# Altium project PCB_Project.PrjPcb
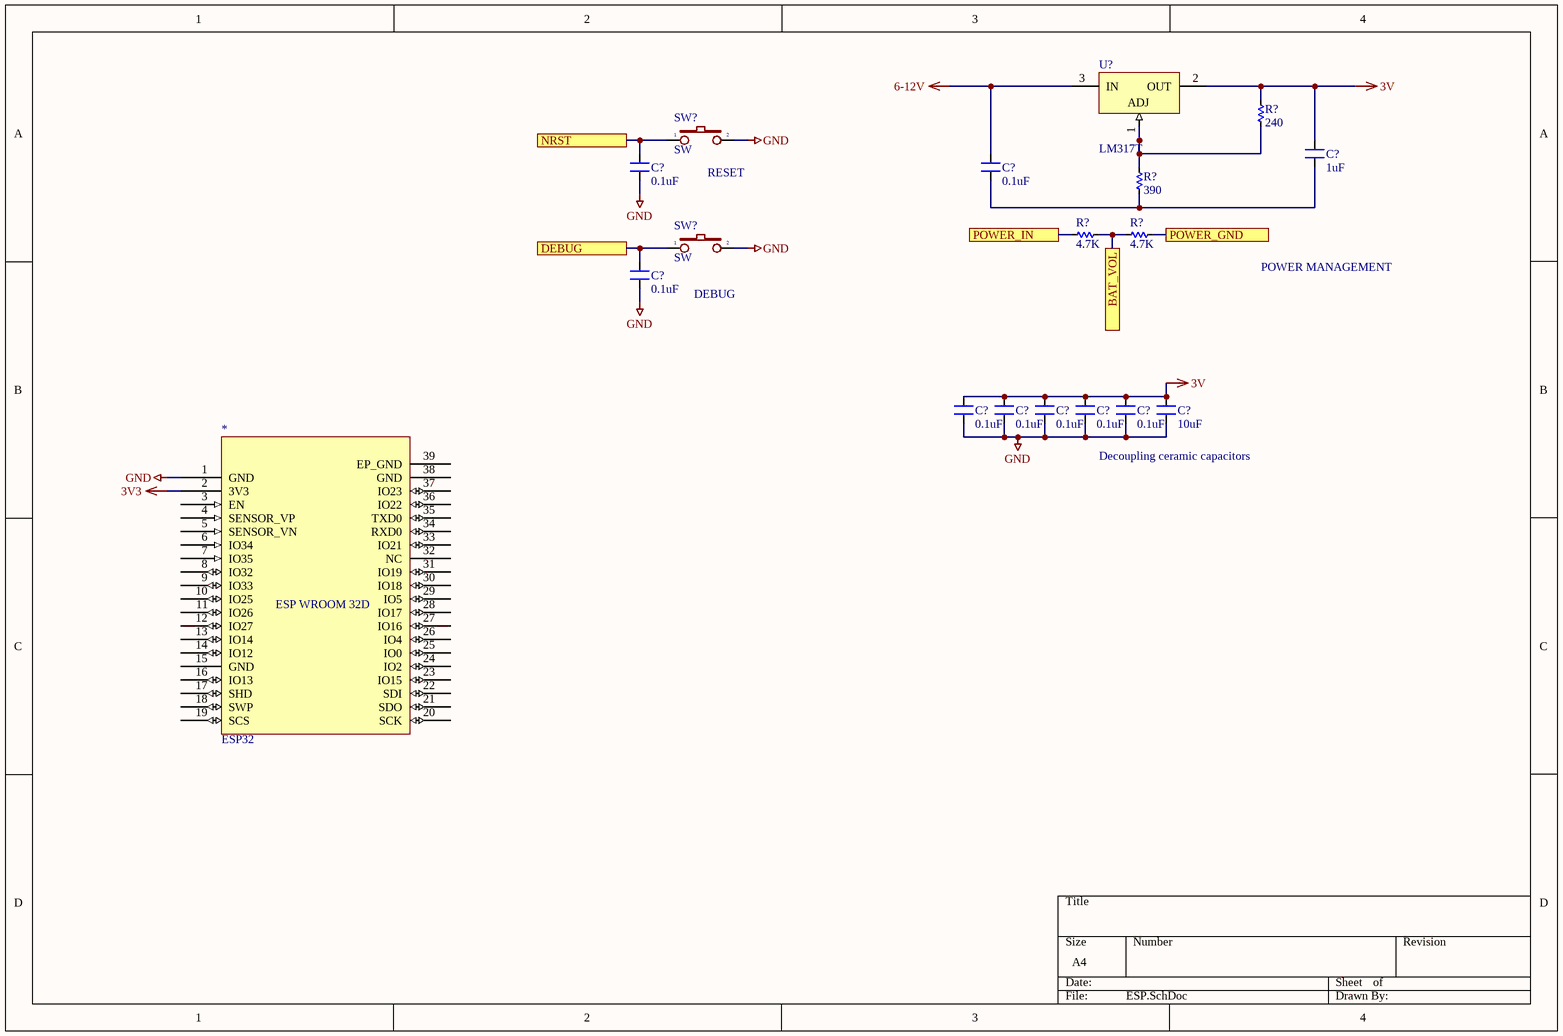
[diagram p0: ESP.SchDoc]
7 sheets, 51 parts. Net scope: flat (ports and power ports of the same name join across sheets).
Sheets:
  ESP.SchDoc
  LEFT.SchDoc
  RIGHT.SchDoc
  DRV.SchDoc
  IRSENSOR.SchDoc
  VL6180.SchDoc
  MPU6500.SchDoc

## Sheet ESP.SchDoc
size A4; SheetNumber: 1; SheetTotal: 7

### Parts
(Parts that share a designator on the sheet are numbered #1, #2 ... from top to bottom, then left to right.)
*  ESP32  [ESP32-WROOM-32D]
C?#1  1uF  [C-SE-7,5x10x9x5x4]
C?#2  0.1uF  [C-SE-7,5x10x9x5x4]
C?#3  0.1uF  [C-SE-7,5x10x9x5x4]
C?#4  0.1uF  [C-SE-7,5x10x9x5x4]
C?#5  0.1uF  [C-SE-7,5x10x9x5x4]
C?#6  0.1uF  [C-SE-7,5x10x9x5x4]
C?#7  0.1uF  [C-SE-7,5x10x9x5x4]
C?#8  0.1uF  [C-SE-7,5x10x9x5x4]
C?#9  0.1uF  [C-SE-7,5x10x9x5x4]
C?#10  10uF  [C-SE-7,5x10x9x5x4]
R?#1  240  [RES-1/2W]
R?#2  390  [RES-1/2W]
R?#3  4.7K  [RES-1/2W]
R?#4  4.7K  [RES-1/2W]
SW?#1  SW  [SW1-SMD]
SW?#2  SW  [SW1-SMD]
U?#1  LM317T  [TO-220]

### Ports
BAT_VOL, DEBUG, NRST, POWER_GND, POWER_IN

### Nets
3V: C?#1.2 C?#5.2 C?#6.2 C?#7.2 C?#8.2 C?#9.2 C?#10.2 R?#1.1 U?#1.2(OUT)
3V3: *.2(3V3)
6-12V: C?#3.2 U?#1.3(IN)
GND: *.1(GND) C?#2.1 C?#4.1 C?#5.1 C?#6.1 C?#7.1 C?#8.1 C?#9.1 C?#10.1 SW?#1.2 SW?#2.2  [project net GND_s]
NetC?#1_1: C?#1.1 C?#3.1 R?#2.2
NetC?#2_2: C?#2.2 SW?#1.1 ; port NRST
NetC?#4_2: C?#4.2 SW?#2.1 ; port DEBUG
NetR?#1_2: R?#1.2 R?#2.1 U?#1.1(ADJ)
NetR?#3_1: R?#3.1 ; port POWER_IN
NetR?#3_2: R?#3.2 R?#4.1 ; port BAT_VOL
NetR?#4_2: R?#4.2 ; port POWER_GND

Not connected (* = marked no-connect by the designer): * 3(EN) 4(SENSOR_VP) 5(SENSOR_VN) 6(IO34) 7(IO35) 8(IO32) 9(IO33) 10(IO25) 11(IO26) 12(IO27) 13(IO14) 14(IO12) 15(GND) 16(IO13) 17(SHD) 18(SWP) 19(SCS) 20(SCK) 21(SDO) 22(SDI) 23(IO15) 24(IO2) 25(IO0) 26(IO4) 27(IO16) 28(IO17) 29(IO5) 30(IO18) 31(IO19) 32(NC) 33(IO21) 34(RXD0) 35(TXD0) 36(IO22) 37(IO23) 38(GND) 39(EP_GND)

### Notes on the sheet
- (near SW?#1) RESET
- DEBUG
- POWER MANAGEMENT
- (near C?#9) Decoupling ceramic capacitors
- (in symbol Component_1) ESP WROOM 32D

### Library data of the parts
* = Component_1
C?#1-C?#10 = CN-SEMI-DIP: Capacitor (Semiconductor SIM Model); Value: 104; LatestRevisionDate: 17-Jul-2002; LatestRevisionNote: Re-released for DXP Platform.; PackageReference: C1206; Publisher: Altium Limited
R?#1-R?#4 = Res: Manufacturer: Generic Components; Class: Passive; SubClass: R; Published: 08/06/2000; Publisher: Altium Hobart Technology Centre
SW?#1 SW?#2 = SW2: Switch button 2 pin; Value: SW chip 2 pin
U?#1 = CMP-0244-00444-1: 1.5A, 1.2V to 37V Adjustable Voltage Regulator, 3-Pin TO-220; PackageVersion: 2011; ComponentLink1URL: http://www.st.com; ComponentLink2URL: http://www.st.com/internet/com/TECHNICAL_RESOURCES/TECHNICAL_LITERATURE/DATASHEET/CD00000455.pdf; PackageDescription: TO, Thru-Hole, Vertical, Heatsink Mounted; 3 In-Line Leads; Pitch 2.54 mm; PackageReference: TO-220; ComponentLink1Description: Manufacturer URL; ComponentLink3URL: http://www.st.com/internet/com/TECHNICAL_RESOURCES/TECHNICAL_LITERATURE/PACKAGE_INFORMATION/CD00004649.pdf; DatasheetVersion: 1/11/2011; ComponentLink2Description: Datasheet; ComponentLink3Description: Package Specification

## Sheet LEFT.SchDoc
size A4; SheetNumber: 2; SheetTotal: 7
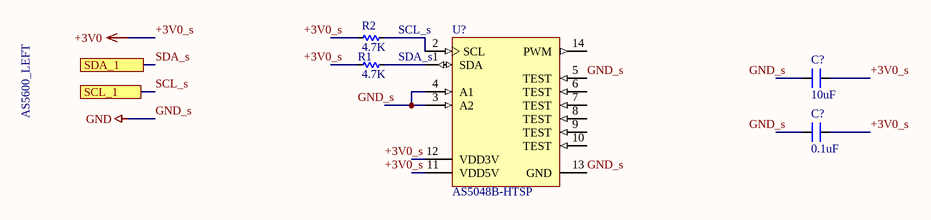
[diagram p1: LEFT.SchDoc]

### Parts
(Parts that share a designator on the sheet are numbered #1, #2 ... from top to bottom, then left to right.)
C?#11  10uF  [C-SE-7,5x10x9x5x4]
C?#12  0.1uF  [C-SE-7,5x10x9x5x4]
R1  4.7K  [RES-1/2W]
R2  4.7K  [RES-1/2W]
U?#2  AS5048B-HTSP  [AMS-TSSOP-14-5000X4400DE_N]

### Ports
SCL_1, SDA_1

### Nets
+3V0_s: C?#11.2 C?#12.2  [also labelled +3V0]
GND_s: U?#2.5(TEST) U?#2.13(GND)  [also labelled GND]
SCL_s: port SCL_1
SDA_s: port SDA_1
NetR1_1: R1.1 U?#2.1(SDA)
NetR2_1: R2.1 U?#2.2(SCL)
NetU?#2_3: U?#2.3(A2) U?#2.4(A1)

Not connected (* = marked no-connect by the designer): C?#11 1; C?#12 1; R1 2; R2 2; U?#2 6(TEST) 7(TEST) 8(TEST) 9(TEST) 10(TEST) 11(VDD5V) 12(VDD3V) 14(PWM)

### Notes on the sheet
- SCL_s
- AS5600_LEFT
- SDA_s
- Labels drawn without touching a wire or pin: +3V0_s, GND_s

### Library data of the parts
C?#11 C?#12 = CN-SEMI-DIP: as C?#1 on sheet ESP; LatestRevisionDate: 17-Jul-2002; LatestRevisionNote: Re-released for DXP Platform.; PackageReference: C1206; Publisher: Altium Limited
R1 R2 = Res: as R?#1 on sheet ESP; Published: 08/06/2000; Publisher: Altium Hobart Technology Centre
U?#2 = CMP-0555-00031-2: Magnetic Rotary Encoder 14-bit Angular Position Sensor, 3.3 or 5 V, TSSOP-14, Pb-Free, Reel; Manufacturer: AMS; Supply Voltage (V): 3.3 or 5.0; Output: IÂ²C, PWM; PackageDescription: 14-Pin Small Outline Package, 5 x 4.4 mm Body, 0.65 mm Pitch; Mounting Technology: Surface Mount; ComponentLink2URL: http://www.ams.com/eng/content/download/438523/1341157/143016; ComponentLink2Description: Datasheet; PackageReference: TSSOP-14; Features: IÂ²C, PWM, In System Programmable; PackageVersion: Rev. 2.7, 10/2010; Code_JEDEC: MO-153; DatasheetVersion: Rev. 1.3; Resolution: 14-bit; PartNumber: AS5048B-HTSP; ComponentLink1Description: Manufacturer URL; ComponentLink1URL: www.ams.com

## Sheet RIGHT.SchDoc
size A4; SheetNumber: 3; SheetTotal: 7
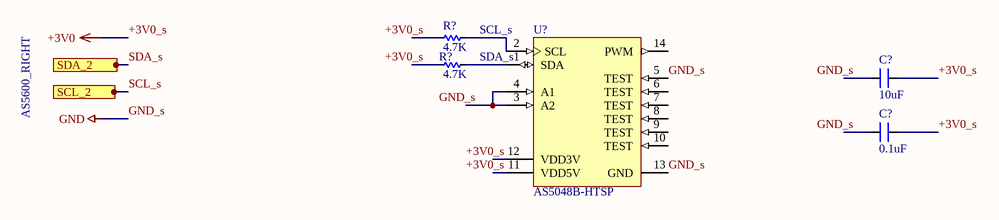
[diagram p2: RIGHT.SchDoc]

### Parts
(Parts that share a designator on the sheet are numbered #1, #2 ... from top to bottom, then left to right.)
C?#13  10uF  [C-SE-7,5x10x9x5x4]
C?#14  0.1uF  [C-SE-7,5x10x9x5x4]
R?#5  4.7K  [RES-1/2W]
R?#6  4.7K  [RES-1/2W]
U?#3  AS5048B-HTSP  [AMS-TSSOP-14-5000X4400DE_N]

### Ports
SCL_2, SDA_2

### Nets
+3V0_s: C?#13.2 C?#14.2  [also labelled +3V0]
GND_s: U?#3.5(TEST) U?#3.13(GND)  [also labelled GND]
SCL_s: port SCL_2
SDA_s: port SDA_2
NetR?#5_1: R?#5.1 U?#3.2(SCL)
NetR?#6_1: R?#6.1 U?#3.1(SDA)
NetU?#3_3: U?#3.3(A2) U?#3.4(A1)

Not connected (* = marked no-connect by the designer): C?#13 1; C?#14 1; R?#5 2; R?#6 2; U?#3 6(TEST) 7(TEST) 8(TEST) 9(TEST) 10(TEST) 11(VDD5V) 12(VDD3V) 14(PWM)

### Notes on the sheet
- SCL_s
- AS5600_RIGHT
- (near R?#6) SDA_s
- Labels drawn without touching a wire or pin: +3V0_s, GND_s

### Library data of the parts
C?#13 C?#14 = CN-SEMI-DIP: as C?#1 on sheet ESP; LatestRevisionDate: 17-Jul-2002; LatestRevisionNote: Re-released for DXP Platform.; PackageReference: C1206; Publisher: Altium Limited
R?#5 R?#6 = Res: as R?#1 on sheet ESP; Published: 08/06/2000; Publisher: Altium Hobart Technology Centre
U?#3 = CMP-0555-00031-2: as U?#2 on sheet LEFT; PackageDescription: 14-Pin Small Outline Package, 5 x 4.4 mm Body, 0.65 mm Pitch; Mounting Technology: Surface Mount; ComponentLink2URL: http://www.ams.com/eng/content/download/438523/1341157/143016; ComponentLink2Description: Datasheet; PackageReference: TSSOP-14; Features: IÂ²C, PWM, In System Programmable; PackageVersion: Rev. 2.7, 10/2010; Code_JEDEC: MO-153; DatasheetVersion: Rev. 1.3; Resolution: 14-bit; PartNumber: AS5048B-HTSP; ComponentLink1Description: Manufacturer URL; ComponentLink1URL: www.ams.com

## Sheet DRV.SchDoc
size A4; SheetNumber: 4; SheetTotal: 7
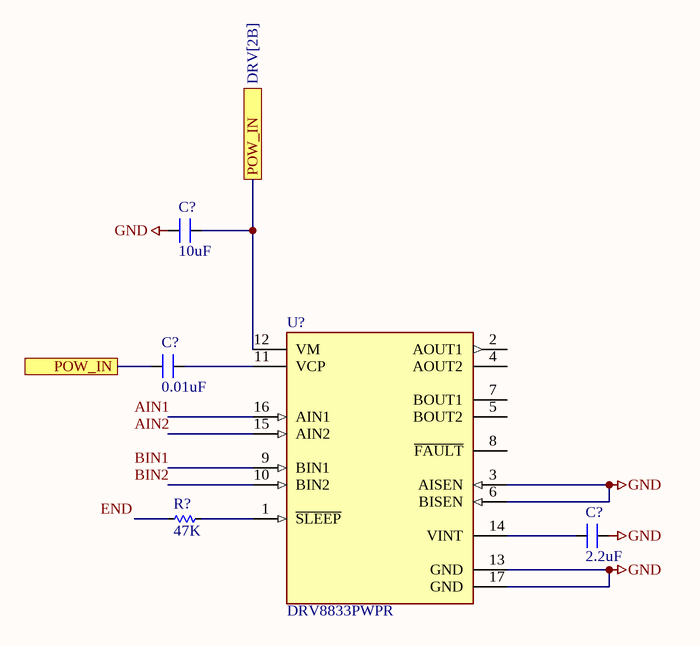
[diagram p3: DRV.SchDoc]

### Parts
(Parts that share a designator on the sheet are numbered #1, #2 ... from top to bottom, then left to right.)
C?#15  10uF  [C-SE-7,5x10x9x5x4]
C?#16  0.01uF  [C-SE-7,5x10x9x5x4]
C?#17  2.2uF  [C-SE-7,5x10x9x5x4]
R?#7  47K  [RES-1/2W]
U?#4  DRV8833PWPR  [FP-PWP0016C-IPC_A]

### Ports
POW_IN, POW_IN (see DRV[2B])

### Nets
GND: C?#15.1 C?#17.2 U?#4.3(AISEN) U?#4.6(BISEN) U?#4.13(GND) U?#4.17(GND)  [project net GND_s]
NetC?#15_2: C?#15.2 C?#16.1 U?#4.12(VM) ; port POW_IN
NetC?#16_2: C?#16.2 U?#4.11(VCP)
NetC?#17_1: C?#17.1 U?#4.14(VINT)
NetR?#7_1: R?#7.1 U?#4.1(~{SLEEP})

Not connected (* = marked no-connect by the designer): R?#7 2; U?#4 2(AOUT1) 4(AOUT2) 5(BOUT2) 7(BOUT1) 8(~{FAULT}) 9(BIN1) 10(BIN2) 15(AIN2) 16(AIN1)

### Notes on the sheet
- Labels drawn without touching a wire or pin: AIN1, AIN2, BIN1, BIN2, END

### Library data of the parts
C?#15-C?#17 = CN-SEMI-DIP: as C?#1 on sheet ESP; LatestRevisionDate: 17-Jul-2002; LatestRevisionNote: Re-released for DXP Platform.; PackageReference: C1206; Publisher: Altium Limited
R?#7 = Res: as R?#1 on sheet ESP; Published: 08/06/2000; Publisher: Altium Hobart Technology Centre
U?#4 = CMP-1529-00004-3: IC MOTOR DRIVER PAR 16HTSSOP; Supply Current: 3mA; Max Output Current: 2A; Interface: PWM; Output Current: 1.5A; Max Supply Voltage: 10.8V; Fault Protection: Over Temperature; Number of Outputs: 2; Min Supply Voltage: 2.7V; Nominal Supply Current: 3mA; Series: DRV8833; Min Operating Temperature: -40°C; Package Quantity: 2000; Packaging: Tape and Reel; Case/Package: HTSSOP; Output Current per Channel: 1.5A; RoHS Compliant: Yes; RMS Current (Irms): 1.5A; Max Operating Temperature: 85°C; Technology: NMOS; Number of Pins: 16; Radiation Hardening: No; Lead Free: Lead Free; REACH SVHC: No SVHC

## Sheet IRSENSOR.SchDoc
size A4; SheetNumber: 5; SheetTotal: 7
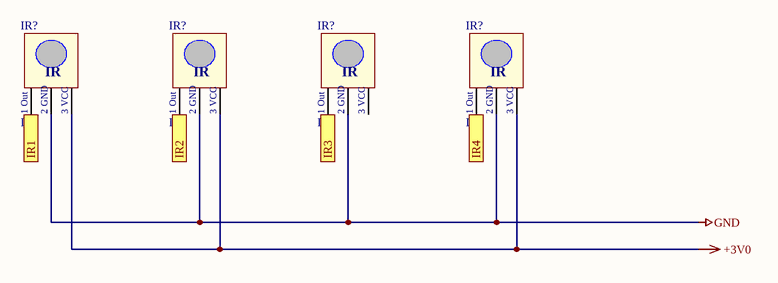
[diagram p4: IRSENSOR.SchDoc]

### Parts
(Parts that share a designator on the sheet are numbered #1, #2 ... from top to bottom, then left to right.)
IR?#1  IR  [JP3-C1T]
IR?#2  IR  [JP3-C1T]
IR?#3  IR  [JP3-C1T]
IR?#4  IR  [JP3-C1T]

### Ports
IR1, IR2, IR3, IR4

### Nets
+3V0: IR?#1.3(VCC) IR?#2.3(VCC) IR?#4.3(VCC)  [project net +3V0_s]
GND: IR?#1.2(GND) IR?#2.2(GND) IR?#3.2(GND) IR?#4.2(GND)  [project net GND_s]
NetIR?#1_1: IR?#1.1(Out) ; port IR1
NetIR?#2_1: IR?#2.1(Out) ; port IR2
NetIR?#3_1: IR?#3.1(Out) ; port IR3
NetIR?#4_1: IR?#4.1(Out) ; port IR4

Not connected (* = marked no-connect by the designer): IR?#3 3(VCC)

### Notes on the sheet
- (in symbol IR) 1 Out; 2 GND; 3 VCC

### Library data of the parts
IR?#1-IR?#4 = IR: Receiver Infraed IC

## Sheet VL6180.SchDoc
size A4; SheetNumber: 6; SheetTotal: 7
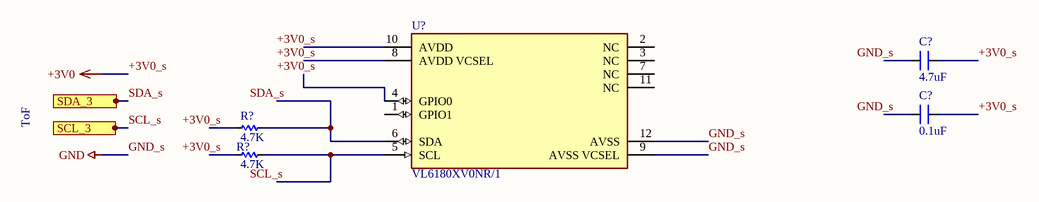
[diagram p5: VL6180.SchDoc]

### Parts
(Parts that share a designator on the sheet are numbered #1, #2 ... from top to bottom, then left to right.)
C?#18  4.7uF  [C-SE-7,5x10x9x5x4]
C?#19  0.1uF  [C-SE-7,5x10x9x5x4]
R?#8  4.7K  [RES-1/2W]
R?#9  4.7K  [RES-1/2W]
U?#5  VL6180XV0NR/1  [FP-VL6180XV0NR-1-MFG]

### Ports
SCL_3, SDA_3

### Nets
+3V0_s: C?#18.2 C?#19.2  [also labelled +3V0]
GND_s: U?#5.9(AVSS_VCSEL) U?#5.12(AVSS)  [also labelled GND]
SCL_s: port SCL_3
SDA_s: port SDA_3
NetR?#8_1: R?#8.1 U?#5.6(SDA)
NetR?#9_1: R?#9.1 U?#5.5(SCL)

Not connected (* = marked no-connect by the designer): C?#18 1; C?#19 1; R?#8 2; R?#9 2; U?#5 1(GPIO1) 2(NC) 3(NC) 4(GPIO0) 7(NC) 8(AVDD_VCSEL) 10(AVDD) 11(NC)

### Notes on the sheet
- ToF
- Labels drawn without touching a wire or pin: +3V0_s, GND_s, SCL_s, SDA_s

### Library data of the parts
C?#18 C?#19 = CN-SEMI-DIP: as C?#1 on sheet ESP; LatestRevisionDate: 17-Jul-2002; LatestRevisionNote: Re-released for DXP Platform.; PackageReference: C1206; Publisher: Altium Limited
R?#8 R?#9 = Res: as R?#1 on sheet ESP; Published: 08/06/2000; Publisher: Altium Hobart Technology Centre
U?#5 = CMP-12183-000001-1: SENSOR OPT AMBIENT 12SMD; Max Supply Voltage: 3V; Sensing Distance: 100mm; Output Type: I2C; Min Supply Voltage: 2.6V; Max Operating Temperature: 70°C; Packaging: Tape and Reel; REACH SVHC: No SVHC; Mount: Surface Mount; Number of Pins: 12; RoHS Compliant: Yes; Case/Package: LGA; Min Operating Temperature: -10°C; Lead Free: Lead Free

## Sheet MPU6500.SchDoc
size A4; SheetNumber: 7; SheetTotal: 7
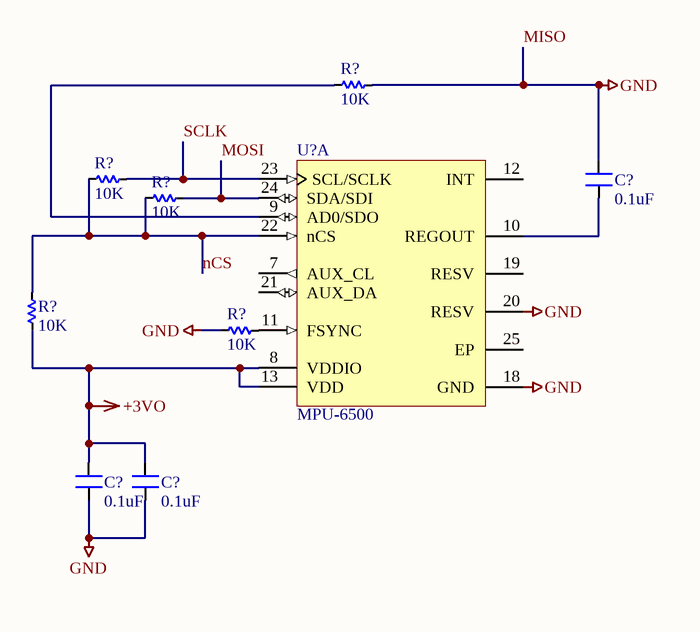
[diagram p6: MPU6500.SchDoc]

### Parts
(Parts that share a designator on the sheet are numbered #1, #2 ... from top to bottom, then left to right.)
C?#20  0.1uF  [C-SE-7,5x10x9x5x4]
C?#21  0.1uF  [C-SE-7,5x10x9x5x4]
C?#22  0.1uF  [C-SE-7,5x10x9x5x4]
R?#10  10K  [RES-1/2W]
R?#11  10K  [RES-1/2W]
R?#12  10K  [RES-1/2W]
R?#13  10K  [RES-1/2W]
R?#14  10K  [RES-1/2W]
U?#6  MPU-6500  [INSE-MPU-6500-QFN24_N]  (part A of 2)

### Nets
+3VO: C?#21.2 C?#22.2 R?#13.2 U?#6.8(VDDIO) U?#6.13(VDD)
GND: C?#20.2 C?#21.1 C?#22.1 R?#10.2 R?#14.2 U?#6.18(GND) U?#6.20(RESV)  [also labelled MISO]  [project net GND_s]
MOSI: R?#12.2 U?#6.24(SDA/SDI)
nCS: R?#11.1 R?#12.1 R?#13.1 U?#6.22(nCS)
SCLK: R?#11.2 U?#6.23(SCL/SCLK)
NetC?#20_1: C?#20.1 U?#6.10(REGOUT)
NetR?#10_1: R?#10.1 U?#6.9(AD0/SDO)
NetR?#14_1: R?#14.1 U?#6.11(FSYNC)

Not connected (* = marked no-connect by the designer): U?#6 7(AUX_CL) 12(INT) 19(RESV) 21(AUX_DA) 25(EP)

### Library data of the parts
C?#20-C?#22 = CN-SEMI-DIP: as C?#1 on sheet ESP; LatestRevisionDate: 17-Jul-2002; LatestRevisionNote: Re-released for DXP Platform.; PackageReference: C1206; Publisher: Altium Limited
R?#10-R?#14 = Res: as R?#1 on sheet ESP; Published: 08/06/2000; Publisher: Altium Hobart Technology Centre
U?#6 = CMP-2000-05154-1: 3-Axis Gyroscope and 3-Axis Accelerometer Motion Processing Unit with I2C and SPI, 1.71 to 3.45 V, -40 to 85 degC, 24-Pin QFN, RoHS, Tape and Reel; Manufacturer: InvenSense; Online Catalog: MPU-6500Series; Output Type: Digital; Sensor Type: GyroscopeandAccelerometer; Featured Product: InvenSense-MPU-6500Six-Axis(Gyro+Acceleromete)MEMSMotionTrackingDevices; Other Names: 1428-1011-6; Article Library: MCUsasSensorHubs; Series: -; Category: Sensors,Transducers; Dynamic Catalog: MPU-6500Series; Standard Package: 1; Manufacturer URL: http://www.invensense.com/; Family: Multifunction; Datasheet Version: Rev. 1.0, 09/2013; Datasheet URL: https://datasheet.ciiva.com/29175/mpu-6500-spec-29175093.pdf

## Nets that join several sheets
+3V0_s: LEFT (C?#11.2 C?#12.2), RIGHT (C?#13.2 C?#14.2), IRSENSOR (IR?#1.3 IR?#2.3 IR?#4.3), VL6180 (C?#18.2 C?#19.2)
GND_s: ESP (11 pins), LEFT (U?#2.5 U?#2.13), RIGHT (U?#3.5 U?#3.13), DRV (6 pins), IRSENSOR (IR?#1.2 IR?#2.2 IR?#3.2 IR?#4.2), VL6180 (U?#5.9 U?#5.12), MPU6500 (7 pins)